# EAGLE design OLED_1_3INCH_I2C (EAGLE 9.6.2)
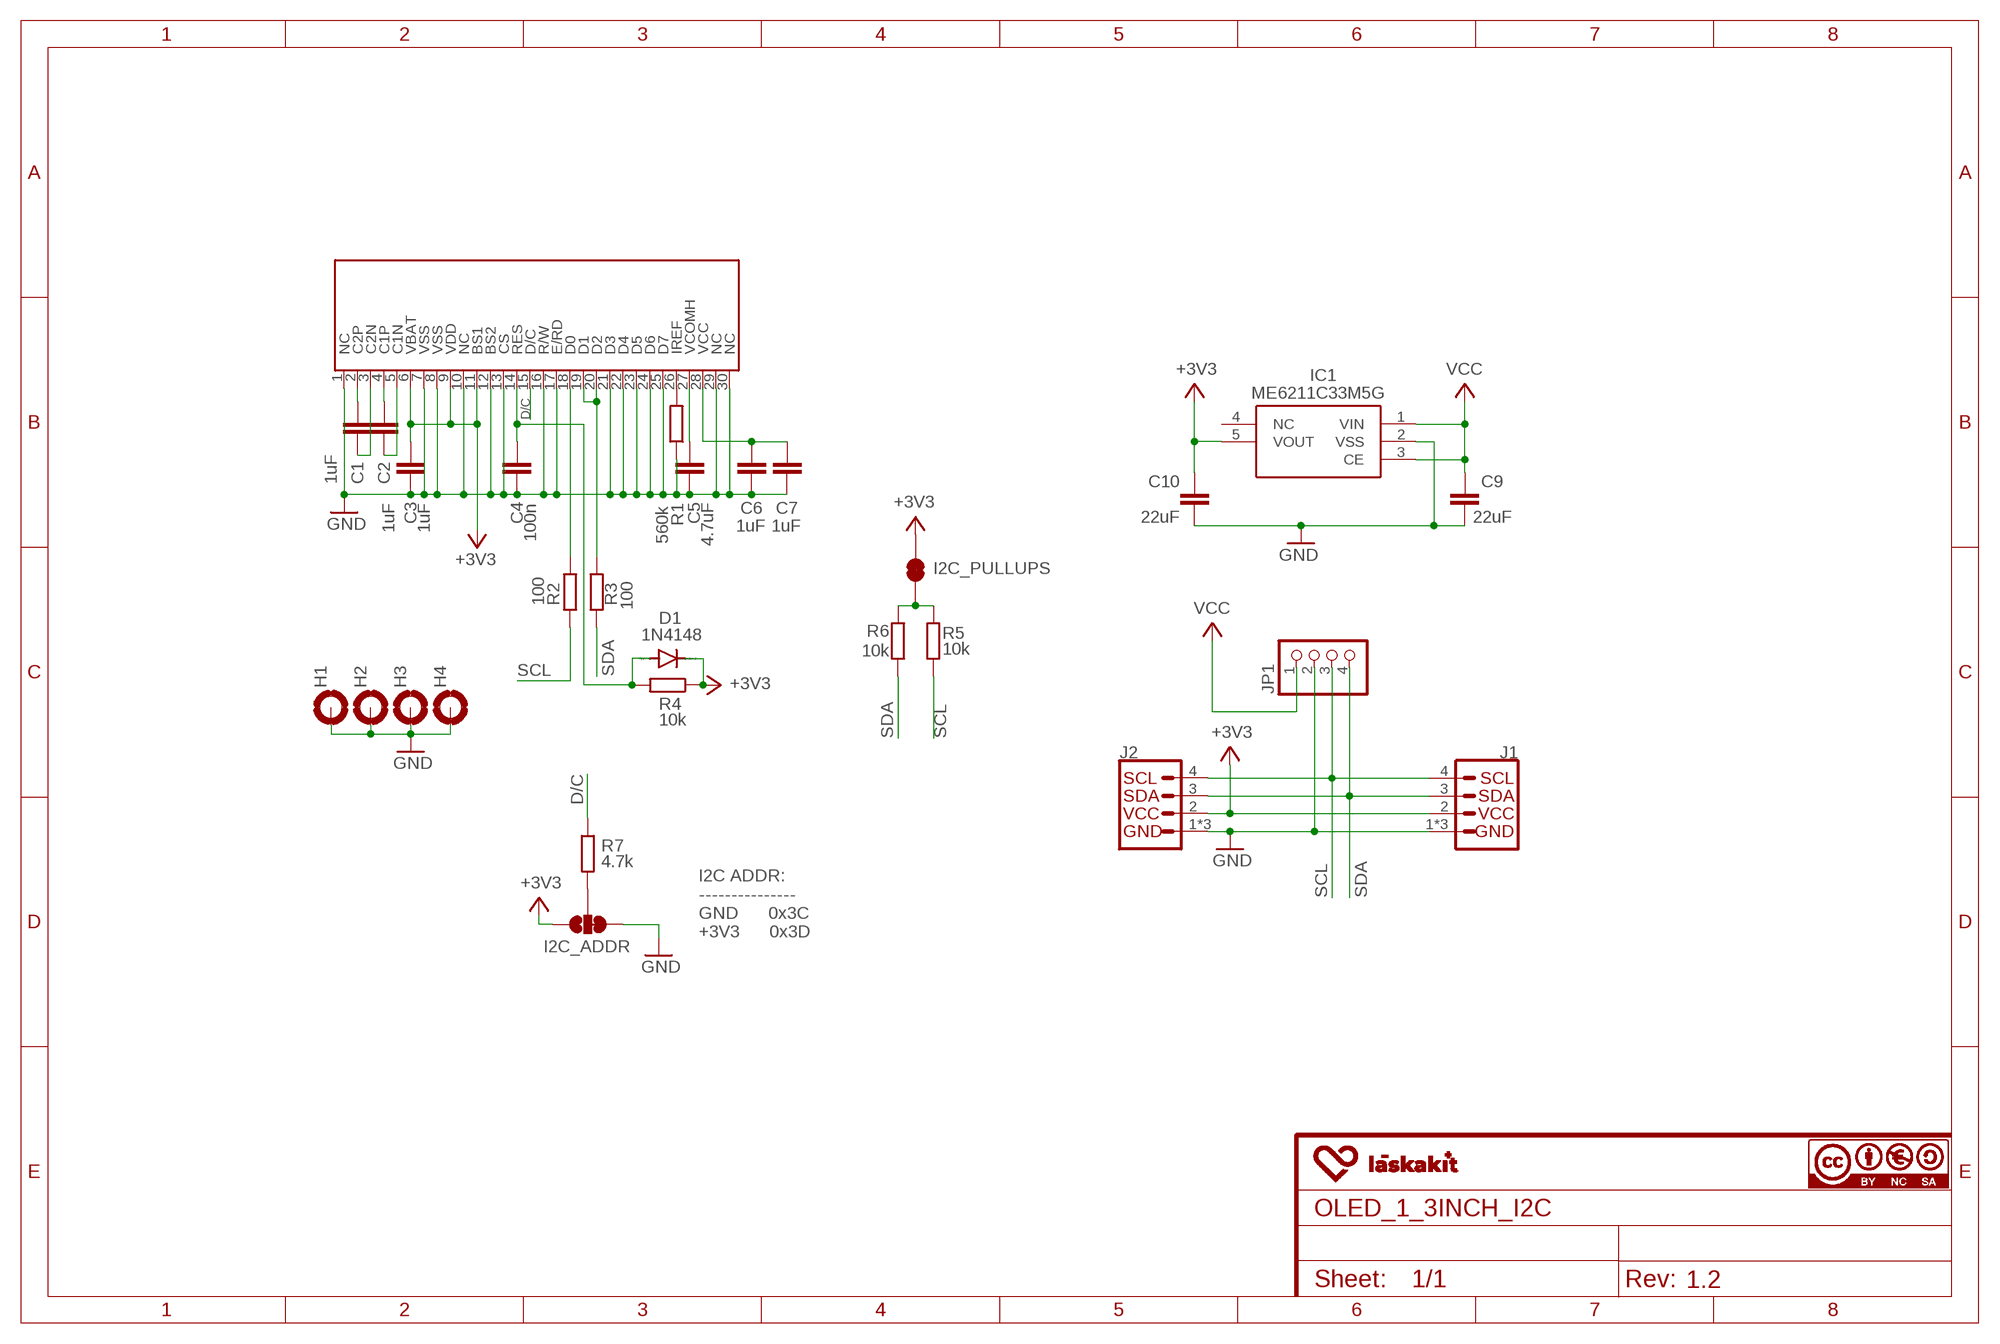
[diagram p0: schematic, sheet 1]
FRAME1 (FRAME-A4L): CREVISION: 1.2

## Parts
C1  1uF  C-EUC0603  [C0603]
C2  1uF  C-EUC0603  [C0603]
C3  1uF  C-EUC0603  [C0603]
C4  100n  C-EUC0603  [C0603]
C5  4.7uF  C-EUC0603  [C0603]
C6  1uF  C-EUC0603  [C0603]
C7  1uF  C-EUC0603  [C0603]
C9  22uF  C-EUC0603  [C0603]
C10  22uF  C-EUC0603  [C0603]
D1  1N4148  DIODE-SOD323-R  [SOD323-R]
DISPLAY1  OLED_1_3INCH  [GME12864_1_3INCH]
H1  MOUNT-PAD-ROUND2.5  [2,5-PAD]
H2  MOUNT-PAD-ROUND2.5  [2,5-PAD]
H3  MOUNT-PAD-ROUND2.5  [2,5-PAD]
H4  MOUNT-PAD-ROUND2.5  [2,5-PAD]
I2C_ADDR  JUMPER-SMT_3_1-NC_TRACE_NO-SILK  [SMT-JUMPER_3_1-NC_TRACE_NO-SILK]
I2C_PULLUPS  JUMPER-SMT_2_NC_TRACE_SILK  [SMT-JUMPER_2_NC_TRACE_SILK]
IC1  ME6211C33M5G  LDO_ME6211C33M5G  [SOT23-5]
J1  USUP_CONNECTOR_HOR  [1X04_1MM_RA]
J2  USUP_CONNECTOR_HOR  [1X04_1MM_RA]
JP1  PINHD-1X4  [1X04]
R1  560k  R-EU_R0603  [R0603]
R2  100  R-EU_R0603  [R0603]
R3  100  R-EU_R0603  [R0603]
R4  10k  R-EU_R0603  [R0603]
R5  10k  R-EU_R0603  [R0603]
R6  10k  R-EU_R0603  [R0603]
R7  4.7k  R-EU_R0603  [R0603]

## Nets
+3V3: C3.1 C10.1 D1.C DISPLAY1.6(VBAT) DISPLAY1.9(VDD) DISPLAY1.11(BS1) I2C_ADDR.1 I2C_PULLUPS.2 IC1.5(VOUT) J1.2(VCC) J2.2(VCC) R4.1
D/C: DISPLAY1.15(D/C) R7.1
GND: C3.2 C4.2 C5.2 C6.2 C7.2 C9.2 C10.2 DISPLAY1.1(NC) DISPLAY1.7(VSS) DISPLAY1.8(VSS) DISPLAY1.10(NC) DISPLAY1.12(BS2) DISPLAY1.13(CS) DISPLAY1.16(R/W) DISPLAY1.17(E/RD) DISPLAY1.21(D3) DISPLAY1.22(D4) DISPLAY1.23(D5) DISPLAY1.24(D6) DISPLAY1.25(D7) DISPLAY1.29(NC) DISPLAY1.30(NC) H1.1(MOUNT) H2.1(MOUNT) H3.1(MOUNT) H4.1(MOUNT) I2C_ADDR.3 IC1.2(VSS) J1.1(GND) J1.NC1(GND) J1.NC2(GND) J2.1(GND) J2.NC1(GND) J2.NC2(GND) JP1.2 R1.1
N$1: C1.2 DISPLAY1.3(C2N)
N$2: C2.2 DISPLAY1.5(C1N)
N$3: C2.1 DISPLAY1.4(C1P)
N$4: C1.1 DISPLAY1.2(C2P)
N$5: I2C_ADDR.2 R7.2
N$6: C4.1 D1.A DISPLAY1.14(RES) R4.2
N$7: C5.1 DISPLAY1.27(VCOMH)
N$8: C6.1 C7.1 DISPLAY1.28(VCC)
N$9: DISPLAY1.26(IREF) R1.2
N$10: DISPLAY1.19(D1) DISPLAY1.20(D2) R3.2
N$11: DISPLAY1.18(D0) R2.2
N$12: I2C_PULLUPS.1 R5.1 R6.1
SCL: J1.4(SCL) J2.4(SCL) JP1.3 R2.1 R5.2
SDA: J1.3(SDA) J2.3(SDA) JP1.4 R3.1 R6.2
VCC: C9.1 IC1.1(VIN) IC1.3(CE) JP1.1
Unconnected: IC1.4(NC)

## Notes on the sheet
- I2C ADDR:
  ---------------
  GND      0x3C
  +3V3      0x3D

## Library data of the parts
C1-C7 C9 C10 = rcl:C-EU: CAPACITOR, European symbol; SPICEPREFIX: C
D1 = LasKKit-Discrete:DIODE-: DIODE
DISPLAY1 = LasKKit-Displays:OLED_1_3INCH
H1-H4 = LasKKit-Holes:MOUNT-PAD-ROUND: MOUNTING PAD, round
I2C_ADDR = LaskaKit-Jumpers:JUMPER-SMT_3_1-NC_TRACE: Normally closed trace jumper (1 of 2 connections) This jumper has a trace between two pads so it's normally closed (NC). The other connection is normally open (NO). Use a razor knife to open the connection. For best results follow the IPC guidelines for cutting traces: Cutout at least 0.063 mm (0.005 in). Remove all loose material to clean up the cut area. Seal the cut with an approved epoxy. Reapply solder to reclose the connection, or to close the NO connection.
I2C_PULLUPS = LaskaKit-Jumpers:JUMPER-SMT_2_NC_TRACE: Normally closed trace jumper This jumper has a trace between two pads so it's normally closed (NC). Use a razor knife to open the connection. For best results follow the IPC guidelines for cutting traces: Cutout at least 0.063 mm (0.005 in). Remove all loose material to clean up the cut area. Seal the cut with an approved epoxy. Reapply solder to reclose the connection.
IC1 = LasKKit-Power:LDO_ME6211C33M5G: High Speed LDO Regulators, High PSRR, Low noise, ME6211 Series Source: Datasheet <http://xinhuidianzi.com.cn/UploadSysFiles/files/LDO-series/ME6211-Series_E15.0.pdf>; DESCRIPTION: High Speed LDO Regulators, High PSRR, Low noise, ME6211 Series; HEIGHT: 1.45mm; MANUFACTURER_NAME: Microne; MANUFACTURER_PART_NUMBER: ME6211C33M5G
J1 J2 = LasKKit-Connectors:USUP_CONNECTOR: LaskaKit I2C Standard Šup Connector An SMD 1mm pitch JST connector makes it easy and quick (Šup) to connect I2C devices to each other. The Šup system enables fast and solderless connection between popular platforms and various sensors and actuators. We carry 200mm <https://www.sparkfun.com/products/14204>, 100mm <https://www.sparkfun.com/products/14205>, 50mm <https://www.sparkfun.com/products/14206>, and breadboard friendly <https://www.sparkfun.com/products/14207> Qwiic cables. We also offer 10 pcs strips <https://www.sparkfun.com/products/14323> the SMD connectors.; LCSC_PART: C145956
JP1 = LasKKit-Connectors:PINHD-1X4: PIN HEADER
R1-R7 = rcl:R-EU_: RESISTOR, European symbol; SPICEPREFIX: R

## Board
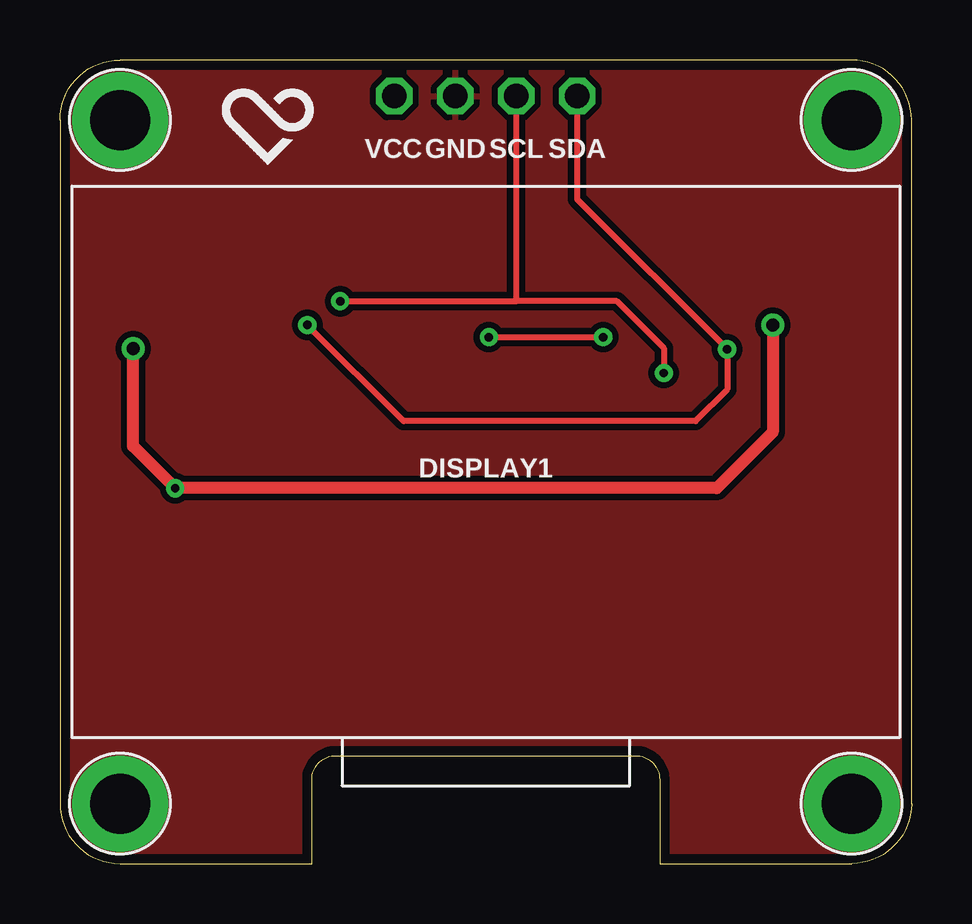
[diagram p1: board, top side]
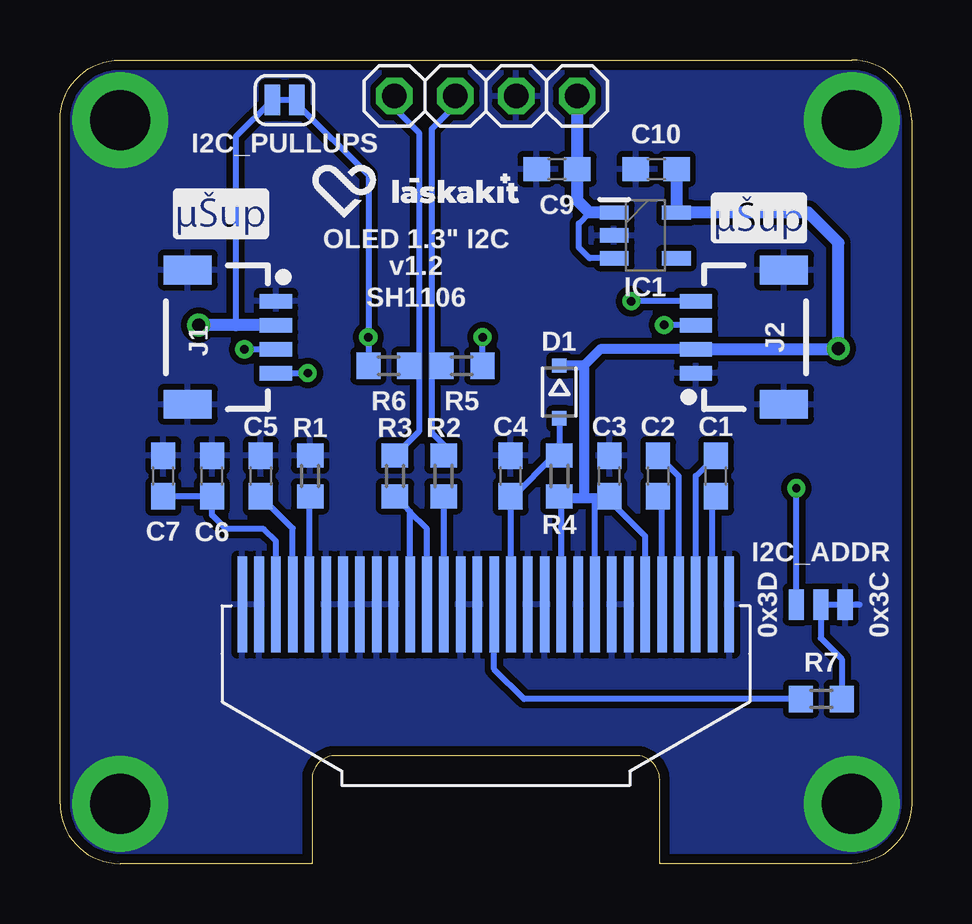
[diagram p2: board, bottom side, seen from below]

Size 35.5 x 33.5 mm. Coordinates in mm from the lower left corner, seen from the top.
Outline: 2.5,0 10.5,0 10.5,3.5 arc-90 11.5,4.5 24,4.5 arc-90 25,3.5 25,0 33,0 arc90 35.5,2.5 35.5,31 arc90 33,33.5 2.5,33.5 arc90 0,31 0,2.5 arc90 2.5,0
Copper layers (1*16): Top 0.035mm / dielectric 1.5mm / Bottom 0.035mm
Design rules "default": minimum track width 6mil, minimum drill 0.2mm, track to track 5mil, track to pad 8mil, pad to pad 6mil, via to via 8mil, smd to smd 6mil, copper to edge 16mil, drill to drill 20mil, minimum pad ring 10mil, minimum via ring 8mil, stop-mask expansion 3mil, vias tented up to drill 24mil, thermal gap 10mil

### Footprints (pad centres in the part's own frame; a part is rotated, then mirrored left to right if it is on the bottom)
C0603 = smd 1.1 x 1: 1 -0.85,0; 2 0.85,0
SOD323-R = smd 0.6 x 0.6: A 1.1,0; C -1.1,0
GME12864_1_3INCH = smd 0.4 x 4 bottom: 1 -10.15,-5.95; 2 -9.45,-5.95; 3 -8.75,-5.95; 4 -8.05,-5.95; 5 -7.35,-5.95; 6 -6.65,-5.95; 7 -5.95,-5.95; 8 -5.25,-5.95; 9 -4.55,-5.95; 10 -3.85,-5.95; 11 -3.15,-5.95; 12 -2.45,-5.95; 13 -1.75,-5.95; 14 -1.05,-5.95; 15 -0.35,-5.95; 16 0.35,-5.95; 17 1.05,-5.95; 18 1.75,-5.95; 19 2.45,-5.95; 20 3.15,-5.95; 21 3.85,-5.95; 22 4.55,-5.95; 23 5.25,-5.95; 24 5.95,-5.95; 25 6.65,-5.95; 26 7.35,-5.95; 27 8.05,-5.95; 28 8.75,-5.95; 29 9.45,-5.95; 30 10.15,-5.95
2,5-PAD = drill 2.5 pad 4: 1 0,0
SMT-JUMPER_3_1-NC_TRACE_NO-SILK = smd 0.635 x 1.27: 1 -1.016,0; 2 0,0; 3 1.016,0
SMT-JUMPER_2_NC_TRACE_SILK = smd 0.635 x 1.27: 1 -0.508,0; 2 0.508,0
SOT23-5 = smd 1.2 x 0.6: 1 -1.3,0.95; 2 -1.3,0; 3 -1.3,-0.95; 4 1.3,-0.95; 5 1.3,0.95
1X04_1MM_RA = smd 0.6 x 1.35: 1 1.5,-1.555; 2 0.5,-1.555; 3 -0.5,-1.555; 4 -1.5,-1.555 | smd 1.2 x 2: NC1 -2.8,2.12; NC2 2.8,2.12
1X04 = drill 1.016 octagon: 1 -3.81,0; 2 -1.27,0; 3 1.27,0; 4 3.81,0
R0603 = smd 1 x 1.1: 1 -0.85,0; 2 0.85,0

### Placement (x,y rotation side)
C1  8.15,16.15 90 bottom
C2  10.57,16.15 270 bottom
C3  12.6,16.15 90 bottom
C4  16.71,16.15 90 bottom
C5  27.13,16.15 90 bottom
C6  29.16,16.15 90 bottom
C7  31.19,16.15 90 bottom
C9  14.78,28.96 180 bottom
C10  10.64,28.96 180 bottom
D1  14.68,19.66 270 bottom
DISPLAY1  17.75,16.75 0 top
H1  33,2.5 0 top
H2  2.5,2.5 0 top
H3  33,31 0 top
H4  2.5,31 0 top
I2C_ADDR  3.78,10.79 0 bottom
I2C_PULLUPS  26.14,31.83 180 bottom
IC1  11.1,26.19 0 bottom
J1  28.05,21.95 90 bottom
J2  7.44,21.95 270 bottom
JP1  17.75,32 180 bottom
R1  25.07,16.15 270 bottom
R2  19.51,16.15 270 bottom
R3  21.54,16.15 270 bottom
R4  14.68,16.15 90 bottom
R5  18.75,20.75 180 bottom
R6  21.79,20.75 0 bottom
R7  3.76,6.86 0 bottom
U$1  [USUP_4MM_SILKSCREEN]  6.35,26.9 0 bottom
U$2  [USUP_4MM_SILKSCREEN]  28.78,27.08 0 bottom
U$3  [LASKAKIT_HEART_4MM]  8.66,30.73 0 top
U$4  [LASKKIT_10MM_SILKSCREEN]  20.65,27.97 0 bottom

### Tracks (layer width: path | path; a pad name or v marks a point on that pad's centre or on a via)
+3V3  (via drill 0.35, 0.55)
  Top 0.508: v3.05,21.46 3.05,17.4 v4.8,15.65 27.38,15.65 29.72,17.98 v29.72,22.45
  Bottom 0.254: DISPLAY1.11 14.6,15.22 R4.1 | C3.1 12.68,15.22 11.1,13.64 DISPLAY1.6 | DISPLAY1.9 13.2,15.21 13.21,15.22 | I2C_ADDR.1 v4.8,15.65 | I2C_PULLUPS.2 28.17,30.3 28.17,22.45
  Bottom 0.406: 12.68,15.22 13.21,15.22 13.64,15.22 | 13.64,15.22 14.6,15.22 | D1.C 13.66,20.75 | 13.66,20.75 13.64,20.75 13.64,15.22 | J2.2 12.97,21.45 13.66,20.75 | v29.71,22.45 v29.72,22.45 | IC1.5
  Bottom 0.508: J1.2 28.17,22.45 v29.71,22.45 | C10.1 IC1.5 | IC1.5 4.3,27.14 3.05,25.88 v3.05,21.46 3.06,21.45 J2.2
D/C
  Bottom 0.254: R7.1 16.15,6.86 17.4,8.1 DISPLAY1.15
GND
  Bottom 0.254: I2C_ADDR.3 2.16,10.79
  pour Top (isolate 0.254): 0,0 0,33.5 35.5,33.5 35.5,0
  pour Bottom (isolate 0.254): 0,0 0,33.5 35.5,33.5 35.5,0
N$1
  Bottom 0.254: DISPLAY1.3 9,16.16 C1.2
N$2
  Bottom 0.254: DISPLAY1.5 10.4,15.14 C2.2
N$3
  Bottom 0.254: DISPLAY1.4 9.7,16.14 C2.1
N$4
  Bottom 0.254: DISPLAY1.2 8.3,15.16 C1.1
N$5
  Bottom 0.254: R7.2 2.91,8.52 3.79,9.4 I2C_ADDR.2
N$6
  Bottom 0.254: DISPLAY1.14 C4.1 | C4.1 | C4.1 16.61,15.29 14.9,17 R4.2 D1.A
N$7
  Bottom 0.254: DISPLAY1.27 25.8,13.98 C5.1
N$8
  Bottom 0.254: DISPLAY1.28 26.5,13.44 27,13.95 28.57,13.95 29.16,14.53 C6.1 C7.1
N$9
  Bottom 0.254: DISPLAY1.26 25.1,15.27 R1.2
N$10
  Bottom 0.254: DISPLAY1.20 20.9,14.66 | 20.9,14.66 21.11,14.88 R3.2 | DISPLAY1.19 20.2,13.96 20.9,14.66
N$11
  Bottom 0.254: DISPLAY1.18 R2.2
N$12  (via drill 0.35)
  Top 0.254: v17.88,21.95 v22.64,21.95
  Bottom 0.254: I2C_PULLUPS.1 25.63,31.67 22.64,28.69 v22.64,21.95 R6.1 | R5.1 17.88,20.77 v17.88,21.95
SCL  (via drill 0.35)
  Top 0.254: v11.68,23.44 19.02,23.44 | v25.17,20.45 25.17,21.49 23.22,23.44 19.02,23.44 | JP1.3 19.02,23.45 19.02,23.44
  Bottom 0.254: R2.1 19.51,17.46 20.01,17.96 20.01,20.78 | 20.01,20.78 20.01,30.61 19.01,31.61 19.01,31.99 JP1.3 | v11.68,23.44 v11.68,23.45 J2.4 | J1.4 v25.17,20.45 | R5.2 19.62,20.78 20.01,20.78
SDA  (via drill 0.35)
  Top 0.254: v10.31,22.45 14.33,18.44 26.49,18.44 27.81,19.76 v27.81,21.44 21.56,27.69 JP1.4
  Bottom 0.254: 20.54,20.75 20.54,30.47 21.54,31.47 21.54,31.98 JP1.4 | 20.54,20.75 20.54,18 R3.1 | v10.31,22.45 v10.3,22.45 J2.3 | v27.81,21.44 v27.8,21.45 J1.3 | R6.2 20.54,20.75
VCC
  Bottom 0.254: C9.1 13.93,29.79 13.94,29.79 | IC1.3 13.43,25.24 13.87,25.68 13.87,26.69 13.42,27.14
  Bottom 0.508: JP1.1 13.94,29.79 13.94,27.66 13.42,27.14 IC1.1

### Text on the board
tNames: VCC | GND | SCL | SDA
bNames: OLED 1.3" I2C | v1.2 | SH1106 | 0x3C | 0x3D